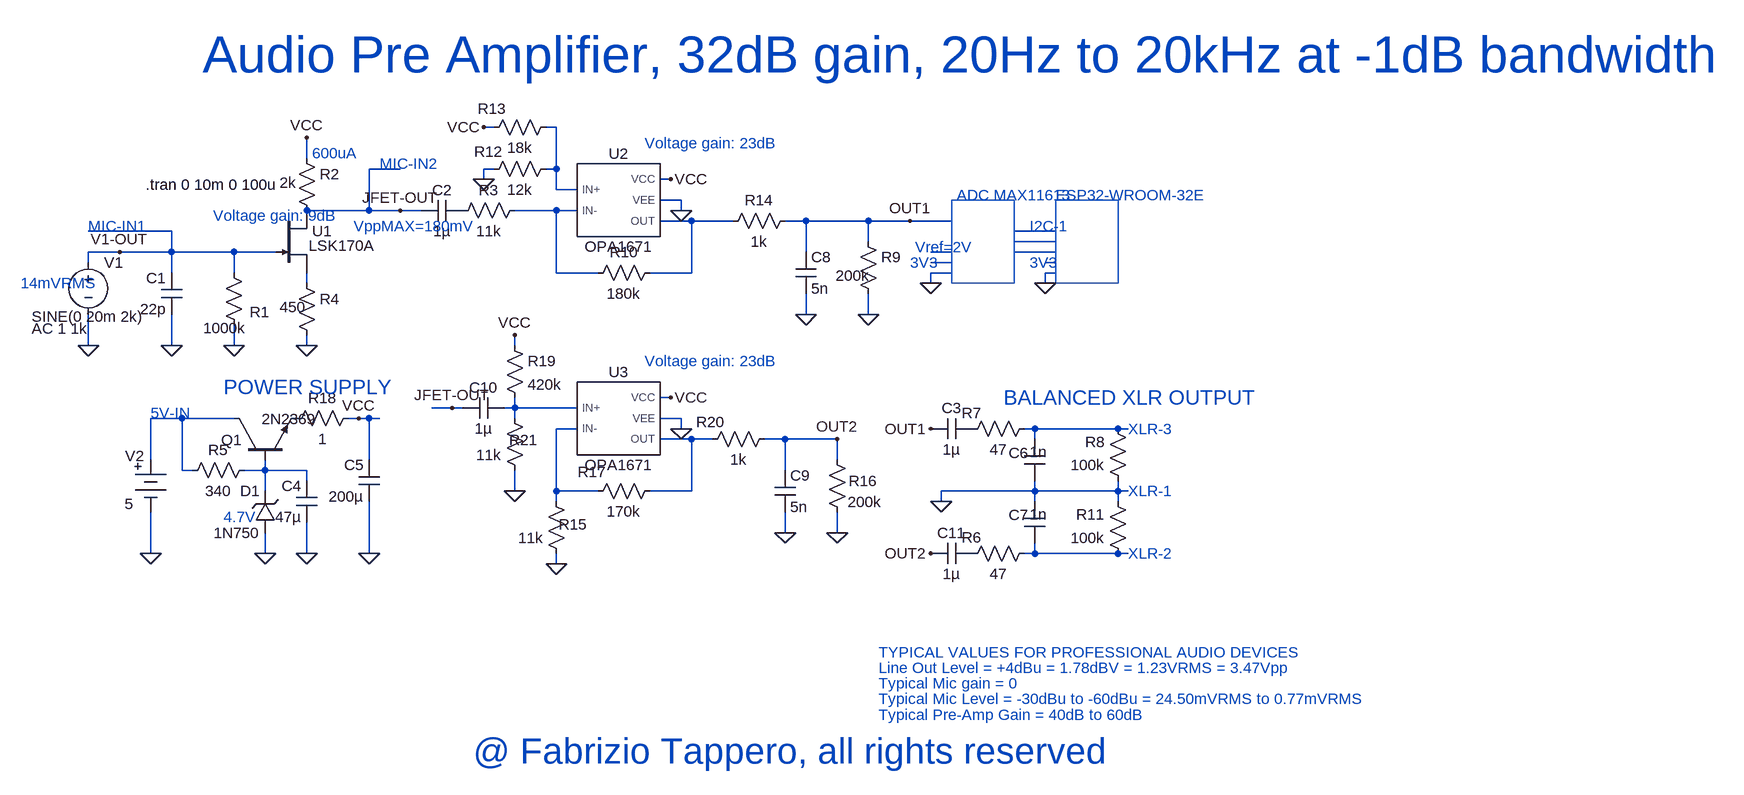
[diagram p0: schematic softmic-sim.asc]
softmic-sim.asc, the LTspice schematic file:
Version 4
SHEET 1 2224 924
WIRE 304 -144 288 -144
WIRE 400 -144 384 -144
WIRE 16 -96 16 -128
WIRE 160 -80 112 -80
WIRE 304 -80 288 -80
WIRE 400 -80 400 -144
WIRE 400 -80 384 -80
WIRE 288 -64 288 -80
WIRE 576 -64 560 -64
WIRE 400 -48 400 -80
WIRE 432 -48 400 -48
WIRE 592 -32 560 -32
WIRE 112 -16 112 -80
WIRE 112 -16 16 -16
WIRE 160 -16 112 -16
WIRE 192 -16 160 -16
WIRE 400 -16 336 -16
WIRE 432 -16 400 -16
WIRE 592 -16 592 -32
WIRE 608 0 560 0
WIRE 672 0 608 0
WIRE 784 0 752 0
WIRE 880 0 784 0
WIRE 944 0 880 0
WIRE 1008 0 944 0
WIRE -192 16 -320 16
WIRE 1168 16 1104 16
WIRE 880 32 880 0
WIRE 1168 32 1104 32
WIRE -272 48 -320 48
WIRE -192 48 -192 16
WIRE -192 48 -272 48
WIRE -96 48 -192 48
WIRE -32 48 -96 48
WIRE 784 48 784 0
WIRE 1008 48 976 48
WIRE 1168 48 1104 48
WIRE -320 64 -320 48
WIRE 1008 64 976 64
WIRE 1168 64 1152 64
WIRE -192 80 -192 48
WIRE -96 80 -96 48
WIRE 400 80 400 -16
WIRE 464 80 400 80
WIRE 608 80 608 0
WIRE 608 80 544 80
WIRE 1008 80 976 80
WIRE 1168 80 1152 80
WIRE 16 96 16 80
WIRE 976 96 976 80
WIRE 1152 96 1152 80
WIRE 784 144 784 112
WIRE 880 144 880 112
WIRE -320 192 -320 144
WIRE -192 192 -192 144
WIRE -96 192 -96 160
WIRE 16 192 16 176
WIRE 336 192 336 176
WIRE 576 272 560 272
WIRE 240 288 208 288
WIRE 256 288 240 288
WIRE 336 288 336 272
WIRE 336 288 320 288
WIRE 432 288 336 288
WIRE -176 304 -224 304
WIRE -96 304 -176 304
WIRE 96 304 80 304
WIRE 112 304 96 304
WIRE 128 304 112 304
WIRE 336 304 336 288
WIRE 592 304 560 304
WIRE 432 320 400 320
WIRE 592 320 592 304
WIRE 1136 320 1120 320
WIRE 1264 320 1136 320
WIRE 1280 320 1264 320
WIRE 608 336 560 336
WIRE 640 336 608 336
WIRE 752 336 720 336
WIRE 832 336 752 336
WIRE 1136 336 1136 320
WIRE -224 368 -224 304
WIRE 112 368 112 304
WIRE 832 368 832 336
WIRE -176 384 -176 304
WIRE -160 384 -176 384
WIRE -48 384 -48 368
WIRE -48 384 -80 384
WIRE 16 384 -48 384
WIRE 752 384 752 336
WIRE 16 400 16 384
WIRE -48 416 -48 384
WIRE 336 416 336 384
WIRE 400 416 400 320
WIRE 464 416 400 416
WIRE 608 416 608 336
WIRE 608 416 544 416
WIRE 1136 416 1136 400
WIRE 1136 416 992 416
WIRE 1264 416 1264 400
WIRE 1264 416 1136 416
WIRE 1280 416 1264 416
WIRE 400 432 400 416
WIRE 992 432 992 416
WIRE 1136 432 1136 416
WIRE 1264 432 1264 416
WIRE 752 480 752 448
WIRE 832 480 832 448
WIRE -224 512 -224 448
WIRE -48 512 -48 480
WIRE 16 512 16 464
WIRE 112 512 112 432
WIRE 1136 512 1136 496
WIRE 1136 512 1120 512
WIRE 1264 512 1136 512
WIRE 1280 512 1264 512
WIRE 400 528 400 512
FLAG -320 192 0
FLAG -192 192 0
FLAG -96 192 0
FLAG 16 192 0
FLAG 112 512 0
FLAG 160 -16 JFET-OUT
FLAG 16 -128 VCC
FLAG 880 144 0
FLAG 576 -64 VCC
FLAG 592 -16 0
FLAG 288 -64 0
FLAG 288 -144 VCC
FLAG 96 304 VCC
FLAG 944 0 OUT1
FLAG -272 48 V1-OUT
FLAG -48 512 0
FLAG -224 512 0
FLAG 992 432 0
FLAG 976 320 OUT1
FLAG 976 96 0
FLAG 1152 96 0
FLAG 16 512 0
FLAG 784 144 0
FLAG 832 480 0
FLAG 576 272 VCC
FLAG 592 320 0
FLAG 336 176 VCC
FLAG 752 480 0
FLAG 240 288 JFET-OUT
FLAG 832 336 OUT2
FLAG 400 528 0
FLAG 336 416 0
FLAG 976 512 OUT2
DATAFLAG 64 -16 ""
DATAFLAG 400 -144 ""
DATAFLAG 128 304 ""
DATAFLAG 384 288 ""
SYMBOL res -112 64 R0
WINDOW 3 -31 101 Left 2
WINDOW 0 40 76 Left 2
SYMATTR Value 1000k
SYMATTR InstName R1
SYMBOL cap -176 144 R180
WINDOW 0 24 56 Left 2
WINDOW 3 24 8 Left 2
SYMATTR InstName C1
SYMATTR Value 22p
SYMBOL voltage -320 48 R0
WINDOW 3 -87 99 Left 2
WINDOW 123 -87 118 Left 2
WINDOW 39 0 0 Left 0
SYMATTR Value SINE(0 20m 2k)
SYMATTR Value2 AC 1 1k
SYMATTR InstName V1
SYMBOL njf -32 -16 R0
WINDOW 3 51 54 Left 2
SYMATTR Value LSK170A
SYMATTR InstName U1
SYMBOL res 0 -112 R0
WINDOW 3 -26 53 Left 2
SYMATTR Value 2k
SYMATTR InstName R2
SYMBOL cap 192 0 R270
WINDOW 0 32 32 VTop 2
WINDOW 3 0 32 VBottom 2
SYMATTR InstName C2
SYMATTR Value 1µ
SYMBOL res 352 -32 R90
WINDOW 3 32 56 VTop 2
WINDOW 0 0 56 VBottom 2
SYMATTR Value 11k
SYMATTR InstName R3
SYMBOL res 0 80 R0
WINDOW 3 -26 53 Left 2
SYMATTR Value 450
SYMATTR InstName R4
SYMBOL res 864 16 R0
WINDOW 3 -34 68 Left 2
SYMATTR Value 200k
SYMATTR InstName R9
SYMBOL res 560 64 R90
WINDOW 3 32 56 VTop 2
WINDOW 0 0 56 VBottom 2
SYMATTR Value 180k
SYMATTR InstName R10
SYMBOL res 288 -64 R270
WINDOW 3 0 56 VBottom 2
WINDOW 0 27 8 VTop 2
SYMATTR Value 12k
SYMATTR InstName R12
SYMBOL res 288 -128 R270
WINDOW 3 0 56 VBottom 2
WINDOW 0 29 13 VTop 2
SYMATTR Value 18k
SYMATTR InstName R13
SYMBOL Misc\\battery -224 352 R0
WINDOW 3 -40 84 Left 2
WINDOW 123 0 0 Left 0
WINDOW 39 0 0 Left 0
WINDOW 0 -39 10 Left 2
SYMATTR Value 5
SYMATTR InstName V2
SYMBOL res -64 368 R90
WINDOW 3 32 56 VTop 2
WINDOW 0 0 56 VBottom 2
SYMATTR Value 340
SYMATTR InstName R5
SYMBOL zener -32 480 R180
WINDOW 0 24 64 Left 2
WINDOW 3 24 0 Left 2
SYMATTR InstName D1
SYMATTR Value 1N750
SYMBOL cap 32 464 R180
WINDOW 0 24 56 Left 2
WINDOW 3 24 8 Left 2
SYMATTR InstName C4
SYMATTR Value 47µ
SYMBOL cap 128 432 R180
WINDOW 0 24 56 Left 2
WINDOW 3 24 8 Left 2
SYMATTR InstName C5
SYMATTR Value 200µ
SYMBOL npn -96 368 R270
WINDOW 0 31 -20 VRight 2
WINDOW 3 63 43 VRight 2
SYMATTR InstName Q1
SYMATTR Value 2N2369
SYMBOL res 1136 496 R90
WINDOW 3 32 56 VTop 2
WINDOW 0 7 97 VBottom 2
SYMATTR Value 47
SYMATTR InstName R6
SYMBOL res 1136 304 R90
WINDOW 3 32 56 VTop 2
WINDOW 0 7 97 VBottom 2
SYMATTR Value 47
SYMATTR InstName R7
SYMBOL cap 1152 400 R180
WINDOW 0 25 43 Left 2
WINDOW 3 -3 44 Left 2
SYMATTR InstName C6
SYMATTR Value 1n
SYMBOL cap 1152 496 R180
WINDOW 0 25 43 Left 2
WINDOW 3 -3 44 Left 2
SYMATTR InstName C7
SYMATTR Value 1n
SYMBOL AutoGenerated\\OPA1671 496 -32 R0
SYMATTR InstName U2
SYMBOL cap 976 336 R270
WINDOW 0 32 32 VTop 2
WINDOW 3 0 32 VBottom 2
SYMATTR InstName C3
SYMATTR Value 1µ
SYMBOL res 1280 416 R180
WINDOW 3 36 40 Left 2
WINDOW 0 36 76 Left 2
SYMATTR Value 100k
SYMATTR InstName R8
SYMBOL res 1280 528 R180
WINDOW 3 36 40 Left 2
WINDOW 0 36 76 Left 2
SYMATTR Value 100k
SYMATTR InstName R11
SYMBOL res 768 -16 R90
WINDOW 3 32 56 VTop 2
WINDOW 0 0 56 VBottom 2
SYMATTR Value 1k
SYMATTR InstName R14
SYMBOL cap 768 48 R0
SYMATTR InstName C8
SYMATTR Value 5n
SYMBOL res 416 528 R180
WINDOW 3 36 40 Left 2
WINDOW 0 -32 61 Left 2
SYMATTR Value 11k
SYMATTR InstName R15
SYMBOL res 816 352 R0
WINDOW 3 32 81 Left 2
WINDOW 0 34 48 Left 2
SYMATTR Value 200k
SYMATTR InstName R16
SYMBOL res 560 400 R90
WINDOW 3 32 56 VTop 2
WINDOW 0 2 105 VBottom 2
SYMATTR Value 170k
SYMATTR InstName R17
SYMBOL res 320 176 R0
SYMATTR Value 420k
SYMATTR InstName R19
SYMBOL AutoGenerated\\OPA1671 496 304 R0
SYMATTR InstName U3
SYMBOL res 736 320 R90
WINDOW 3 32 56 VTop 2
WINDOW 0 5 99 VBottom 2
SYMATTR Value 1k
SYMATTR InstName R20
SYMBOL cap 736 384 R0
SYMATTR InstName C9
SYMATTR Value 5n
SYMBOL cap 256 304 R270
WINDOW 0 32 32 VTop 2
WINDOW 3 0 32 VBottom 2
SYMATTR InstName C10
SYMATTR Value 1µ
SYMBOL res 352 400 R180
WINDOW 3 36 40 Left 2
WINDOW 0 -20 63 Left 2
SYMATTR Value 11k
SYMATTR InstName R21
SYMBOL cap 976 528 R270
WINDOW 0 32 32 VTop 2
WINDOW 3 0 32 VBottom 2
SYMATTR InstName C11
SYMATTR Value 1µ
SYMBOL res 96 288 R90
WINDOW 3 32 56 VTop 2
WINDOW 0 0 56 VBottom 2
SYMATTR Value 1
SYMATTR InstName R18
TEXT -232 -56 Left 2 !.tran 0 10m 0 100u
TEXT -128 -8 Left 2 ;Voltage gain: 9dB
TEXT 24 -104 Left 2 ;600uA
TEXT 536 -120 Left 2 ;Voltage gain: 23dB
TEXT 1016 -40 Left 2 ;ADC MAX11613
TEXT -112 456 Left 2 ;4.7V
TEXT -320 8 Left 2 ;MIC-IN1
TEXT 1280 416 Left 2 ;XLR-1
TEXT 1280 512 Left 2 ;XLR-2
TEXT 1280 320 Left 2 ;XLR-3
TEXT -112 256 Left 3 ;POWER SUPPLY
TEXT 1088 272 Left 3 ;BALANCED XLR OUTPUT
TEXT -224 296 Left 2 ;5V-IN
TEXT 1168 -40 Left 2 ;ESP32-WROOM-32E
TEXT 1128 8 Left 2 ;I2C-1
TEXT 128 -88 Left 2 ;MIC-IN2
TEXT 896 688 Left 2 ;Line Out Level = +4dBu = 1.78dBV = 1.23VRMS = 3.47Vpp
TEXT 896 712 Left 2 ;Typical Mic gain = 0
TEXT 896 736 Left 2 ;Typical Mic Level = -30dBu to -60dBu = 24.50mVRMS to 0.77mVRMS
TEXT -424 96 Left 2 ;14mVRMS
TEXT -144 -256 Left 6 ;Audio Pre Amplifier, 32dB gain, 20Hz to 20kHz at -1dB bandwidth
TEXT 896 664 Left 2 ;TYPICAL VALUES FOR PROFESSIONAL AUDIO DEVICES
TEXT 536 216 Left 2 ;Voltage gain: 23dB
TEXT 896 760 Left 2 ;Typical Pre-Amp Gain = 40dB to 60dB
TEXT 88 8 Left 2 ;VppMAX=180mV
TEXT 952 40 Left 2 ;Vref=2V
TEXT 944 64 Left 2 ;3V3
TEXT 1128 64 Left 2 ;3V3
TEXT 272 816 Left 5 ;@ Fabrizio Tappero, all rights reserved
RECTANGLE Normal 1104 96 1008 -32
RECTANGLE Normal 1264 96 1168 -32

The netlist it stands for:
* softmic-sim.asc
R1 V1-OUT 0 1000k
C1 0 V1-OUT 22p
V1 V1-OUT 0 SINE(0 20m 2k) AC 1 1k
J§U1 JFET-OUT V1-OUT N010 LSK170A
R2 VCC JFET-OUT 2k
C2 JFET-OUT P001 1µ
R3 N002 P001 11k
R4 N010 0 450
R9 OUT1 0 200k
R10 N003 N002 180k
R12 0 N001 12k
R13 VCC N001 18k
V2 N012 0 5
R5 N016 N012 340
D1 0 N016 1N750
C4 0 N016 47µ
C5 0 VCC 200µ
Q1 N012 N016 P002 0 2N2369
R6 N017 P003 47
R7 N014 P004 47
C6 0 N014 1n
C7 N017 0 1n
XU2 N001 N002 VCC 0 N003 OPA1671  ; pins IN+ IN- VCC VEE OUT
C3 OUT1 P004 1µ
R8 0 N014 100k
R11 N017 0 100k
R14 OUT1 N003 1k
C8 OUT1 0 5n
R15 0 N013 11k
R16 OUT2 0 200k
R17 N015 N013 170k
R19 VCC N011 420k
XU3 N011 N013 VCC 0 N015 OPA1671  ; pins IN+ IN- VCC VEE OUT
R20 OUT2 N015 1k
C9 OUT2 0 5n
C10 JFET-OUT N011 1µ
R21 0 N011 11k
C11 OUT2 P003 1µ
R18 VCC P002 1
.model D D
.lib standard.dio
.model NPN NPN
.model PNP PNP
.lib standard.bjt
.model NJF NJF
.model PJF PJF
.lib standard.jft
.tran 0 10m 0 100u
* Voltage gain: 9dB
* 600uA
* Voltage gain: 23dB
* ADC MAX11613
* 4.7V
* MIC-IN1
* XLR-1
* XLR-2
* XLR-3
* POWER SUPPLY
* BALANCED XLR OUTPUT
* 5V-IN
* ESP32-WROOM-32E
* I2C-1
* MIC-IN2
* Line Out Level = +4dBu = 1.78dBV = 1.23VRMS = 3.47Vpp
* Typical Mic gain = 0
* Typical Mic Level = -30dBu to -60dBu = 24.50mVRMS to 0.77mVRMS
* 14mVRMS
* Audio Pre Amplifier, 32dB gain, 20Hz to 20kHz at -1dB bandwidth
* TYPICAL VALUES FOR PROFESSIONAL AUDIO DEVICES
* Voltage gain: 23dB
* Typical Pre-Amp Gain = 40dB to 60dB
* VppMAX=180mV
* Vref=2V
* 3V3
* 3V3
* @ Fabrizio Tappero, all rights reserved
.lib C:\Users\fabrizio\Desktop\OPA1671.lib
.backanno
.end